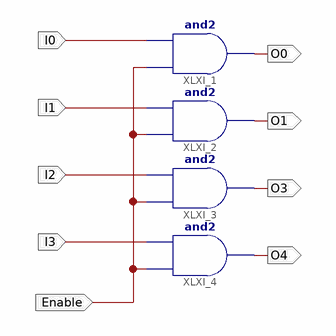
[diagram p0: schematic sheet 1]
// Xilinx ISE schematic buf4e.sch (spartan6) as structural Verilog: 4 symbols, 9 ports
module buf4e (
  input  I0,
  input  I1,
  input  I2,
  input  I3,
  input  Enable,
  output O0,
  output O1,
  output O3,
  output O4
);

  and XLXI_1 (O0, Enable, I0);
  and XLXI_2 (O1, Enable, I1);
  and XLXI_3 (O3, Enable, I2);
  and XLXI_4 (O4, Enable, I3);
endmodule
